# Altium schematic sheet MCU_L4.SchDoc
size A4; SheetNumber: 5; SheetTotal: 6
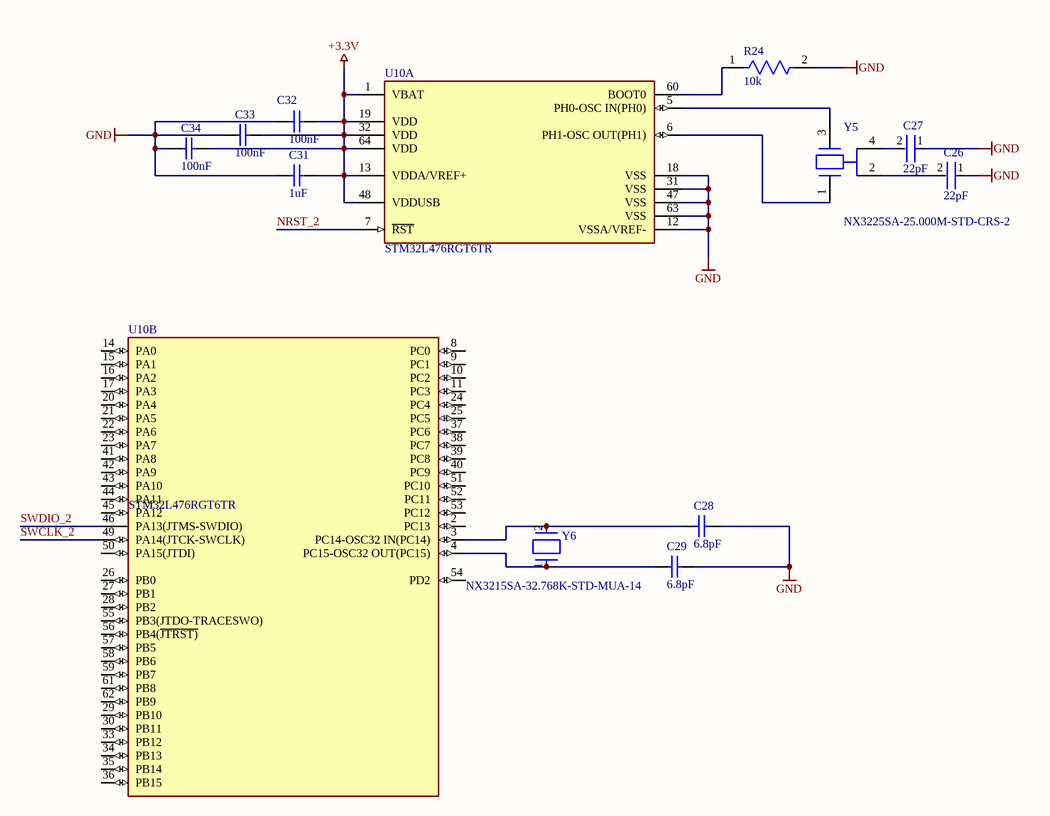
[diagram p0: MCU_L4.SchDoc]

## Parts
C26  22pF  [FP-C0805C-DN-MFG]
C27  22pF  [FP-C0805C-DN-MFG]
C28  6.8pF  [CAPC2013X94X50NL20T25]
C29  6.8pF  [CAPC2013X94X50NL20T25]
C31  1uF  [CAPC2013X145X50NL20T20]
C32  100nF  [CAPC2013X140X50ML20T25]
C33  100nF  [CAPC2013X140X50ML20T25]
C34  100nF  [CAPC2013X140X50ML20T25]
R24  10k  [FP-CRGP0805-IPC_C]
U10  STM32L476RGT6TR  [FP-LQFP64-5W-MFG]  (parts A,B of 2)
Y5  NX3225SA-25.000M-STD-CRS-2  [FP-NX3225SA-MFG]
Y6  NX3215SA-32.768K-STD-MUA-14  [FP-NX3215SA-MFG]

## Nets
+3.3V: C31.1 C32.2 C33.2 C34.2 U10.1(VBAT) U10.13(VDDA/VREF+) U10.19(VDD) U10.32(VDD) U10.48(VDDUSB) U10.64(VDD)
GND: C26.1 C27.1 C28.1 C29.2 C31.2 C32.1 C33.1 C34.1 R24.2 U10.12(VSSA/VREF-) U10.18(VSS) U10.31(VSS) U10.47(VSS) U10.63(VSS)
NRST_2: U10.7(~{RST})
SWCLK_2: U10.49(PA14(JTCK-SWCLK))
SWDIO_2: U10.46(PA13(JTMS-SWDIO))
NetC26_2: C26.2 Y5.2(GND)
NetC27_2: C27.2 Y5.4(GND)
NetC28_2: C28.2 U10.3(PC14-OSC32_IN(PC14)) Y6.2
NetC29_1: C29.1 U10.4(PC15-OSC32_OUT(PC15)) Y6.1
NetR24_1: R24.1 U10.60(BOOT0)
NetU10_5: U10.5(PH0-OSC_IN(PH0)) Y5.3
NetU10_6: U10.6(PH1-OSC_OUT(PH1)) Y5.1

Not connected (* = marked no-connect by the designer): U10 2(PC13) 8(PC0) 9(PC1) 10(PC2) 11(PC3) 14(PA0) 15(PA1) 16(PA2) 17(PA3) 20(PA4) 21(PA5) 22(PA6) 23(PA7) 24(PC4) 25(PC5) 26(PB0) 27(PB1) 28(PB2) 29(PB10) 30(PB11) 33(PB12) 34(PB13) 35(PB14) 36(PB15) 37(PC6) 38(PC7) 39(PC8) 40(PC9) 41(PA8) 42(PA9) 43(PA10) 44(PA11) 45(PA12) 50(PA15(JTDI)) 51(PC10) 52(PC11) 53(PC12) 54(PD2) 55(PB3(JTDO-TRACESWO)) 56(PB4(~{JTRST)}) 57(PB5) 58(PB6) 59(PB7) 61(PB8) 62(PB9)

## Library data of the parts
C26 C27 = CMP-2007-00314-2: CAP CER 22PF 100V 10% NP0 0805; Manufacturer Part Number: C0805C220K1GACTU; Manufacturer: KEMET; Temperature Characteristic: C0G; Tolerance: 0.1; Material: Ceramic; Temperature Coefficient: 30ppm/°C; ComponentLink2Description: Datasheet; Digikey Description: CAP CER 22PF 100V 10% NP0 0805; Value: 22 pF; Temperature Range High: +125°C; Package: C0805C-DN; Voltage Rating: 100 V; Octopart: https://octopart.com/c0805c220k1gactu-kemet-9138624; Capacitance: 22 pF; Lead Free: Yes; Temperature: -55°C to +125°C; Category: Cap; Device Class L3: Ceramic Capacitors; ComponentLink2URL: https://content.kemet.com/datasheets/KEM_C1003_C0G_SMD.pdf; Ipc Land Pattern Name: CAPC200125X78; Automotive: No; Mouser Description: Cap Ceramic 22pF 100V C0G 10% SMD 0805 125°C Plastic T/R; RoHS: TRUE; Height: 0.88mm; Device Class L1: Passive Components; Temperature Range Low: -55°C; Device Class L2: Capacitors
C28 C29 = CMP-2007-04154-1: Part Number: 08051A6R8DAT2A; Manufacturer: AVX Interconnect / Elco
C31 = CMP-2007-01676-1: Part Number: VJ0805Y105KXQRW1BC; Manufacturer: Vitramon
C32-C34 = CMP-2007-04651-1: Part Number: 0805DD104KAT2A; Manufacturer: AVX Interconnect / Elco
R24 = CMP-03211-006861-1: CRGP 0805 10K 1%; Manufacturer Part Number: CRGP0805F10K; Manufacturer: TE; Power Rating: 0.33W; Voltage Rating: 150V; Value: 10KΩ; Tolerance: 0.01; Temperature Coefficient: ±100ppm/°C; ComponentLink2URL: https://www.mouser.com/datasheet/2/418/NG_DS_9-1773463-9_A-1358566.pdf; Temperature Range Low: -55°C; Ipc Land Pattern Name: RESC200125X55; Device Class L2: Resistors; Automotive: No; Device Class L3: Chip SMD Resistors; Composition: Thick Film; Temperature Range High: +155°C; Temperature: -55°C to +155°C; Height: 0.65mm; Series: CRGP; RoHS: TRUE; Device Class L1: Passive Components; Octopart: https://octopart.com/crgp0805f10k-te+connectivity-91018782; Package: CRGP0805; Digikey Description: CRGP 0805 10K 1%; Ambient Temperature Range High: +70°C; Lead Free: Yes; ComponentLink2Description: Datasheet; Category: Res; Resistance: 10KΩ
U10 = CMP-12105-000039-1: IC MCU 32BIT 1MB FLASH 64LQFP; Manufacturer: STMicroelectronics; Number Of Timers/Counters: 13; Number Of Spi Channels: 3; Number Of Pwm Channels: 28; Number Of Usb Channels: 1; Frequency: 80MHz; Data Bus Width: 32bits; Max Supply Voltage: 3.6V; Ram Size: 128KBytes; Memory Size: 1MBytes; Number Of Uart Channels: 6; Number Of Adc Channels: 16; Core Architecture: ARM Cortex-M4; Standoff Height: 0.05mm; Interface: I2C,SPI,UART,USART,CAN,USB,LIN,IrDA,SMBus,Other; Max Junction Temp: +105°C; Min Supply Voltage: 1.71V; Number Of I/Os: 51; Temperature Range Low: -40°C; Automotive: No; Ambient Temperature Range Low: -40°C; ComponentLink2URL: https://www.st.com/content/ccc/resource/technical/document/datasheet/c5/ed/2f/60/aa/79/42/0b/DM00108832.pdf/files/DM00108832.pdf/jcr:content/translations/en.DM00108832.pdf; Temperature: -40°C to +105°C; Device Class L1: Integrated Circuits (ICs); Package: LQFP64-5W; Category: IC; Memory Type: FLASH; Digikey Description: IC MCU 32BIT 1MB FLASH 64LQFP; Number Of A/D Converters: 3; Number Of I2C Channels: 3; Temperature Range High: +105°C; Lead Free: Yes; Number Of Cores: 1; Height: 1.6mm; Ambient Temperature Range High: +85°C; Device Class L2: Embedded Processors and Controllers; Octopart: https://octopart.com/stm32l476rgt6tr-stmicroelectronics-74146120; RoHS: TRUE; Ipc Land Pattern Name: QFP50P1200X1200X160-64; Mouser Description: MCU 32-Bit STM32 ARM Cortex M4 RISC 1MB Flash 1.8V/2.5V/3.3V 64-Pin LQFP T/R; ComponentLink2Description: Datasheet; Manufacturer Part Number: STM32L476RGT6TR; Device Class L3: Microcontrollers
Y5 = CMP-200220-000002-1: CRYSTAL 25.0000MHZ 8PF SMD; Manufacturer: NDK; Frequency: 25MHz; Automotive Grade: Grade 1; Esr: 100Ω; Tolerance: 15ppm; Digikey Description: CRYSTAL 25.0000MHZ 8PF SMD; Temperature Range Low: -40°C; Octopart: https://octopart.com/nx3225sa-25.000m-std-crs-2-ndk-51374293; Series: NX3225SA; Manufacturer Part Number: NX3225SA-25.000M-STD-CRS-2; ComponentLink2URL: https://www.ndk.com/images/products/catalog/c_NX3225SA-STD-CRS-2_e.pdf; Lead Free: Yes; Device Class L2: Crystals / Oscillators; ComponentLink2Description: Datasheet; Device Class L3: Crystals; Category: Crys; Device Class L1: Passive Components; Automotive: Yes; RoHS: TRUE; Load Capacitance: 8pF; Height: 0.6mm; Temperature Range High: +125°C; Package: NX3225SA; Temperature: -40°C to +125°C
Y6 = CMP-00536-22488149-1: NX3215SA-32.768K-STD-MUA-14 Parallel - Fundamental Quartz Crystal, 0.032768MHz Nom; ESR (Equivalent Series Resistance): 70kΩ; Frequency Tolerance: 0.002%; Load Capacitance: 6pF; Frequency: 32.768kHz; Width: 1.4986mm; Length: 3.2004mm; RoHS: Compliant; Case/Package: SMD/SMT; Mount: Surface Mount; Height: 889µm; Number of Pins: 2; Packaging: Tape & Reel (TR); Max Operating Temperature: 85°C; NexarPartId: 22488149; Min Operating Temperature: -40°C